# Altium project ET4207_DEBUG.PrjPcb
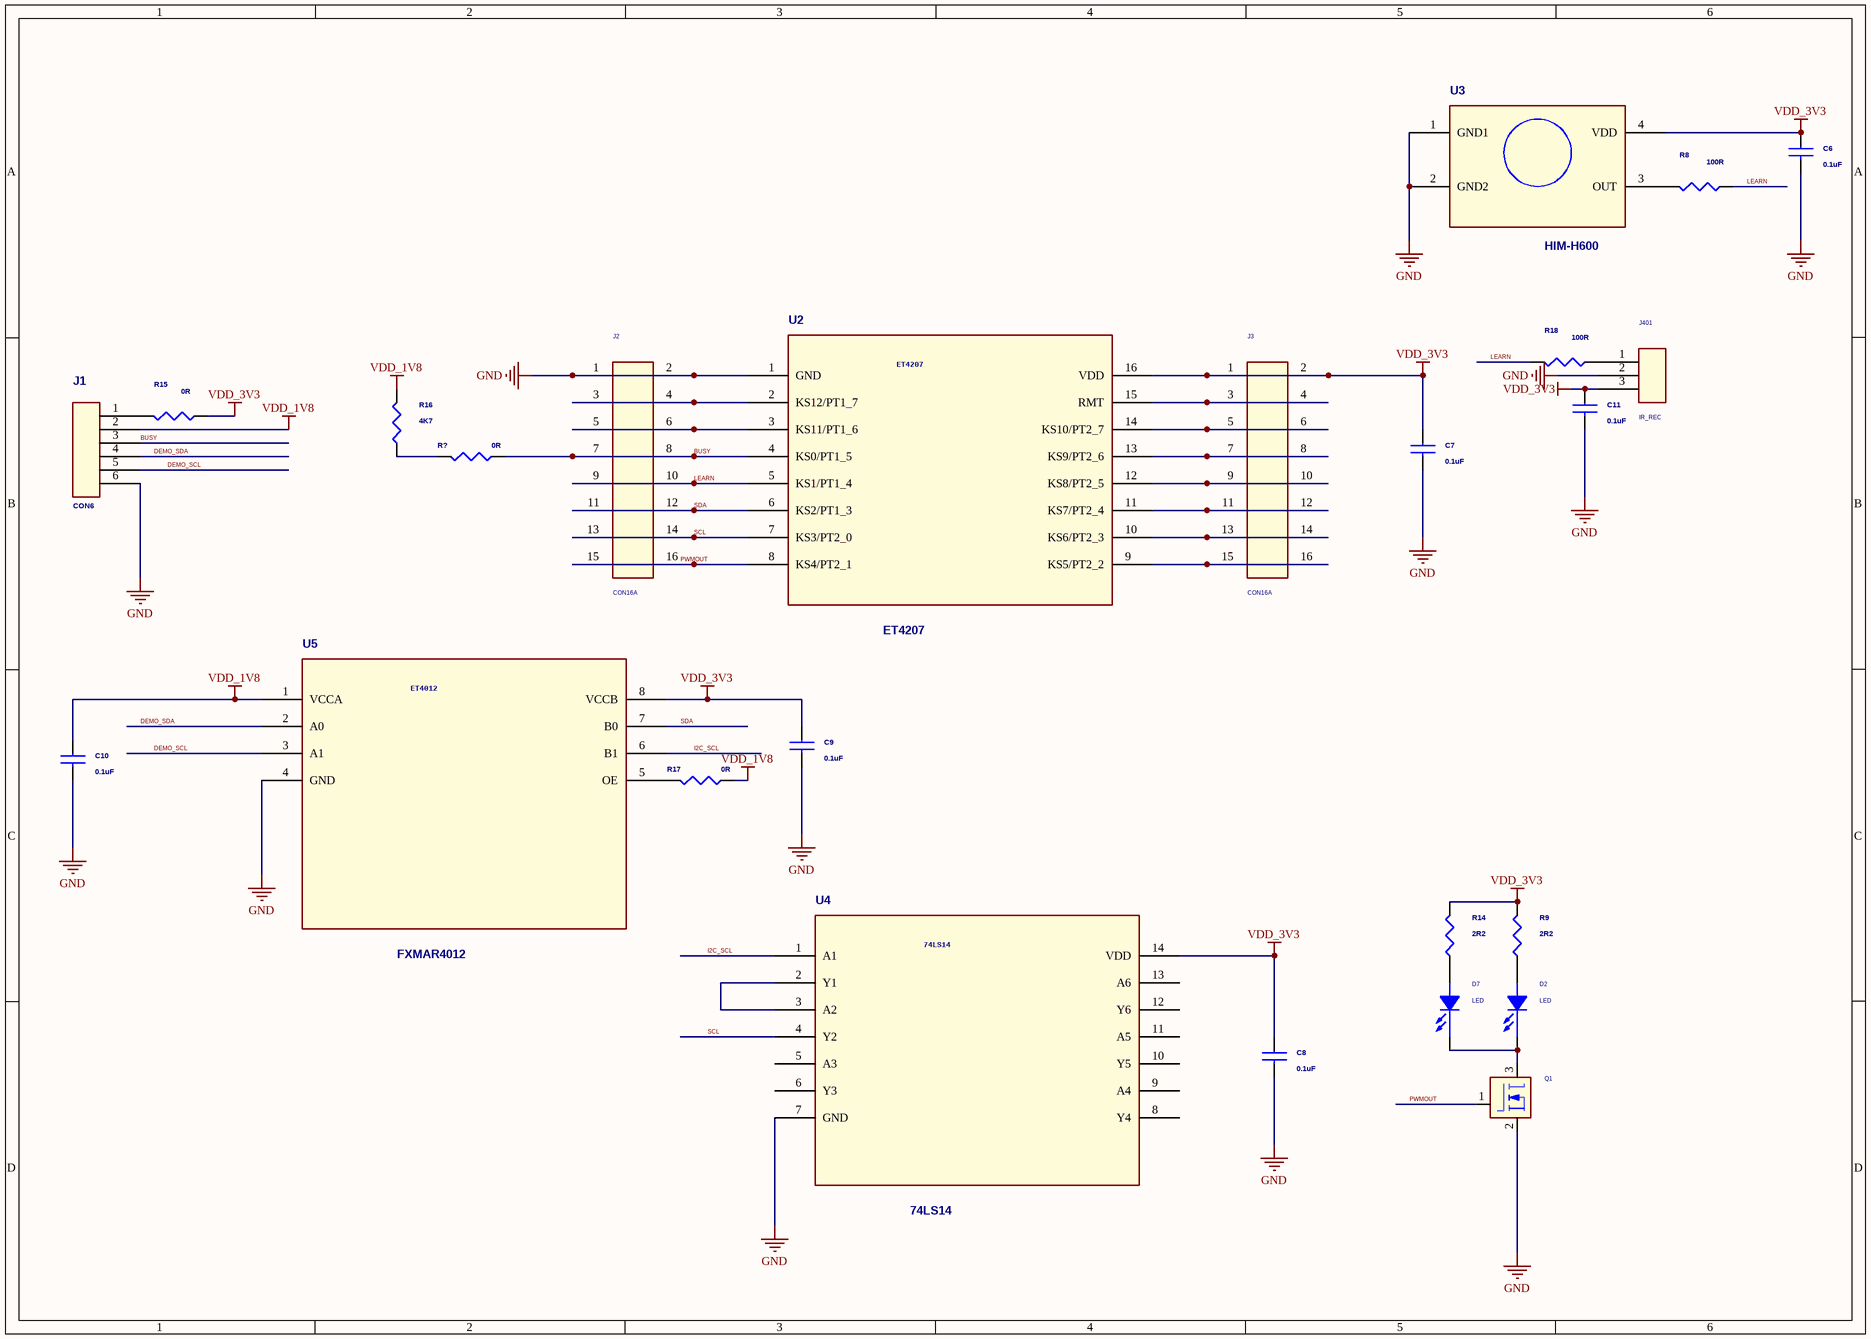
[diagram p0: ET4207_DEBUG.SchDoc]
2 sheets, 25 parts. Net scope: global (net labels, ports and power ports of the same name join across sheets).
Sheets:
  ET4207_DEBUG.SchDoc
  02 Block.SchDoc

## Sheet ET4207_DEBUG.SchDoc
size 350 x 250 mm

### Parts
C6  0.1uF  [SC0805]
C7  0.1uF  [SC0805]
C8  0.1uF  [SC0805]
C9  0.1uF  [SC0805]
C10  0.1uF  [SC0805]
C11  0.1uF  [SC0805]
D2  LED  [LED_0805d]
D7  LED  [LED_0805d]
J1  CON6  [hx6v]
J2  CON16A  [DIP16-2.54]
J3  CON16A  [HDR16P254]
J401  IR_REC  [LED_DUL]
Q1  BSS138LT3G  [SOT_23_321]  (value not drawn)
R8  100R  [SR0805]
R9  2R2  [SR0805]
R14  2R2  [SR0805]
R15  0R  [SR0805]
R16  4K7  [SR0805]
R17  0R  [SR0805]
R18  100R  [SR0805]
R?  0R  [SR0805]
U2  ET4207  [SOP16]
U3  HIM-H600  [LEDSC254P435X510X80-4N]
U4  74LS14  [sop14]
U5  FXMAR4012  [umlp8]

### Nets
GND: C6.2 C7.2 C8.2 C9.2 C10.2 C11.2 J1.6 J2.1 J2.2 J401.2(GND) Q1.2(S) U2.1(GND) U3.1(GND1) U3.2(GND2) U4.7(GND) U5.4(GND)
VDD_1V8: C10.1 J1.2 R16.2 R17.1 U5.1(VCCA)
VDD_3V3: C6.1 C7.1 C8.1 C9.1 C11.1 J3.1 J3.2 J401.3(VCC) R9.2 R14.2 R15.1 U2.16(VDD) U3.4(VDD) U4.14(VDD) U5.8(VCCB)
BUSY: J1.3 J2.7 J2.8 R?.1 U2.4(KS0/PT1_5)
DEMO_SCL: J1.5 U5.3(A1)
DEMO_SDA: J1.4 U5.2(A0)
I2C_SCL: U4.1(A1) U5.6(B1)
LEARN: J2.9 J2.10 R8.1 R18.2 U2.5(KS1/PT1_4)
PWMOUT: J2.15 J2.16 Q1.1(G) U2.8(KS4/PT2_1)
SCL: J2.13 J2.14 U2.7(KS3/PT2_0) U4.4(Y2)
SDA: J2.11 J2.12 U2.6(KS2/PT1_3) U5.7(B0)
NetD2_1: D2.1(ANODE) R9.1
NetD2_2: D2.2(CATHODE) D7.2(CATHODE) Q1.3(D)
NetD7_1: D7.1(ANODE) R14.1
NetJ1_1: J1.1 R15.2
NetJ2_3: J2.3 J2.4 U2.2(KS12/PT1_7)
NetJ2_5: J2.5 J2.6 U2.3(KS11/PT1_6)
NetJ3_3: J3.3 J3.4 U2.15(RMT)
NetJ3_5: J3.5 J3.6 U2.14(KS10/PT2_7)
NetJ3_7: J3.7 J3.8 U2.13(KS9/PT2_6)
NetJ3_9: J3.9 J3.10 U2.12(KS8/PT2_5)
NetJ3_11: J3.11 J3.12 U2.11(KS7/PT2_4)
NetJ3_13: J3.13 J3.14 U2.10(KS6/PT2_3)
NetJ3_15: J3.15 J3.16 U2.9(KS5/PT2_2)
NetJ401_1: J401.1(IROUT) R18.1
NetR8_2: R8.2 U3.3(OUT)
NetR16_1: R16.1 R?.2
NetR17_2: R17.2 U5.5(OE)
NetU4_2: U4.2(Y1) U4.3(A2)

Not connected (* = marked no-connect by the designer): U4 5(A3) 6(Y3) 8(Y4) 9(A4) 10(Y5) 11(A5) 12(Y6) 13(A6)

### Notes on the sheet
- (in symbol STM32F103C8_2) ET4012

### Library data of the parts
C6-C11 = CAPACITOR NON-POL
D2 D7 = LED_3
J2 J3 = CON16A_0
J401 = CON3_0
Q1 = MOSFET_I_EN_GSD: MOSFET N-CH 50V 200MA SOT-23; TI_Part_No: TI-MOS-BSS138LT3G; Mfr_Name: On Semi; Distributor_Part_Number: BSS138LT3GOSCT-ND; Datasheet: http://www.onsemi.com/pub_link/Collateral/BSS138LT1-D.PDF; Mfr_Part_Number: BSS138LT3G
R8 R9 R14-R18 R? = RESISTOR: MODULE: CPU
U2 = STM32F103C8_0
U3 = LPC111x_7: DEVICE: ET4003YD; MODULE: CPU
U4 = STM32F103C8_1
U5 = STM32F103C8_2

## Sheet 02 Block.SchDoc
size 420 x 297 mm
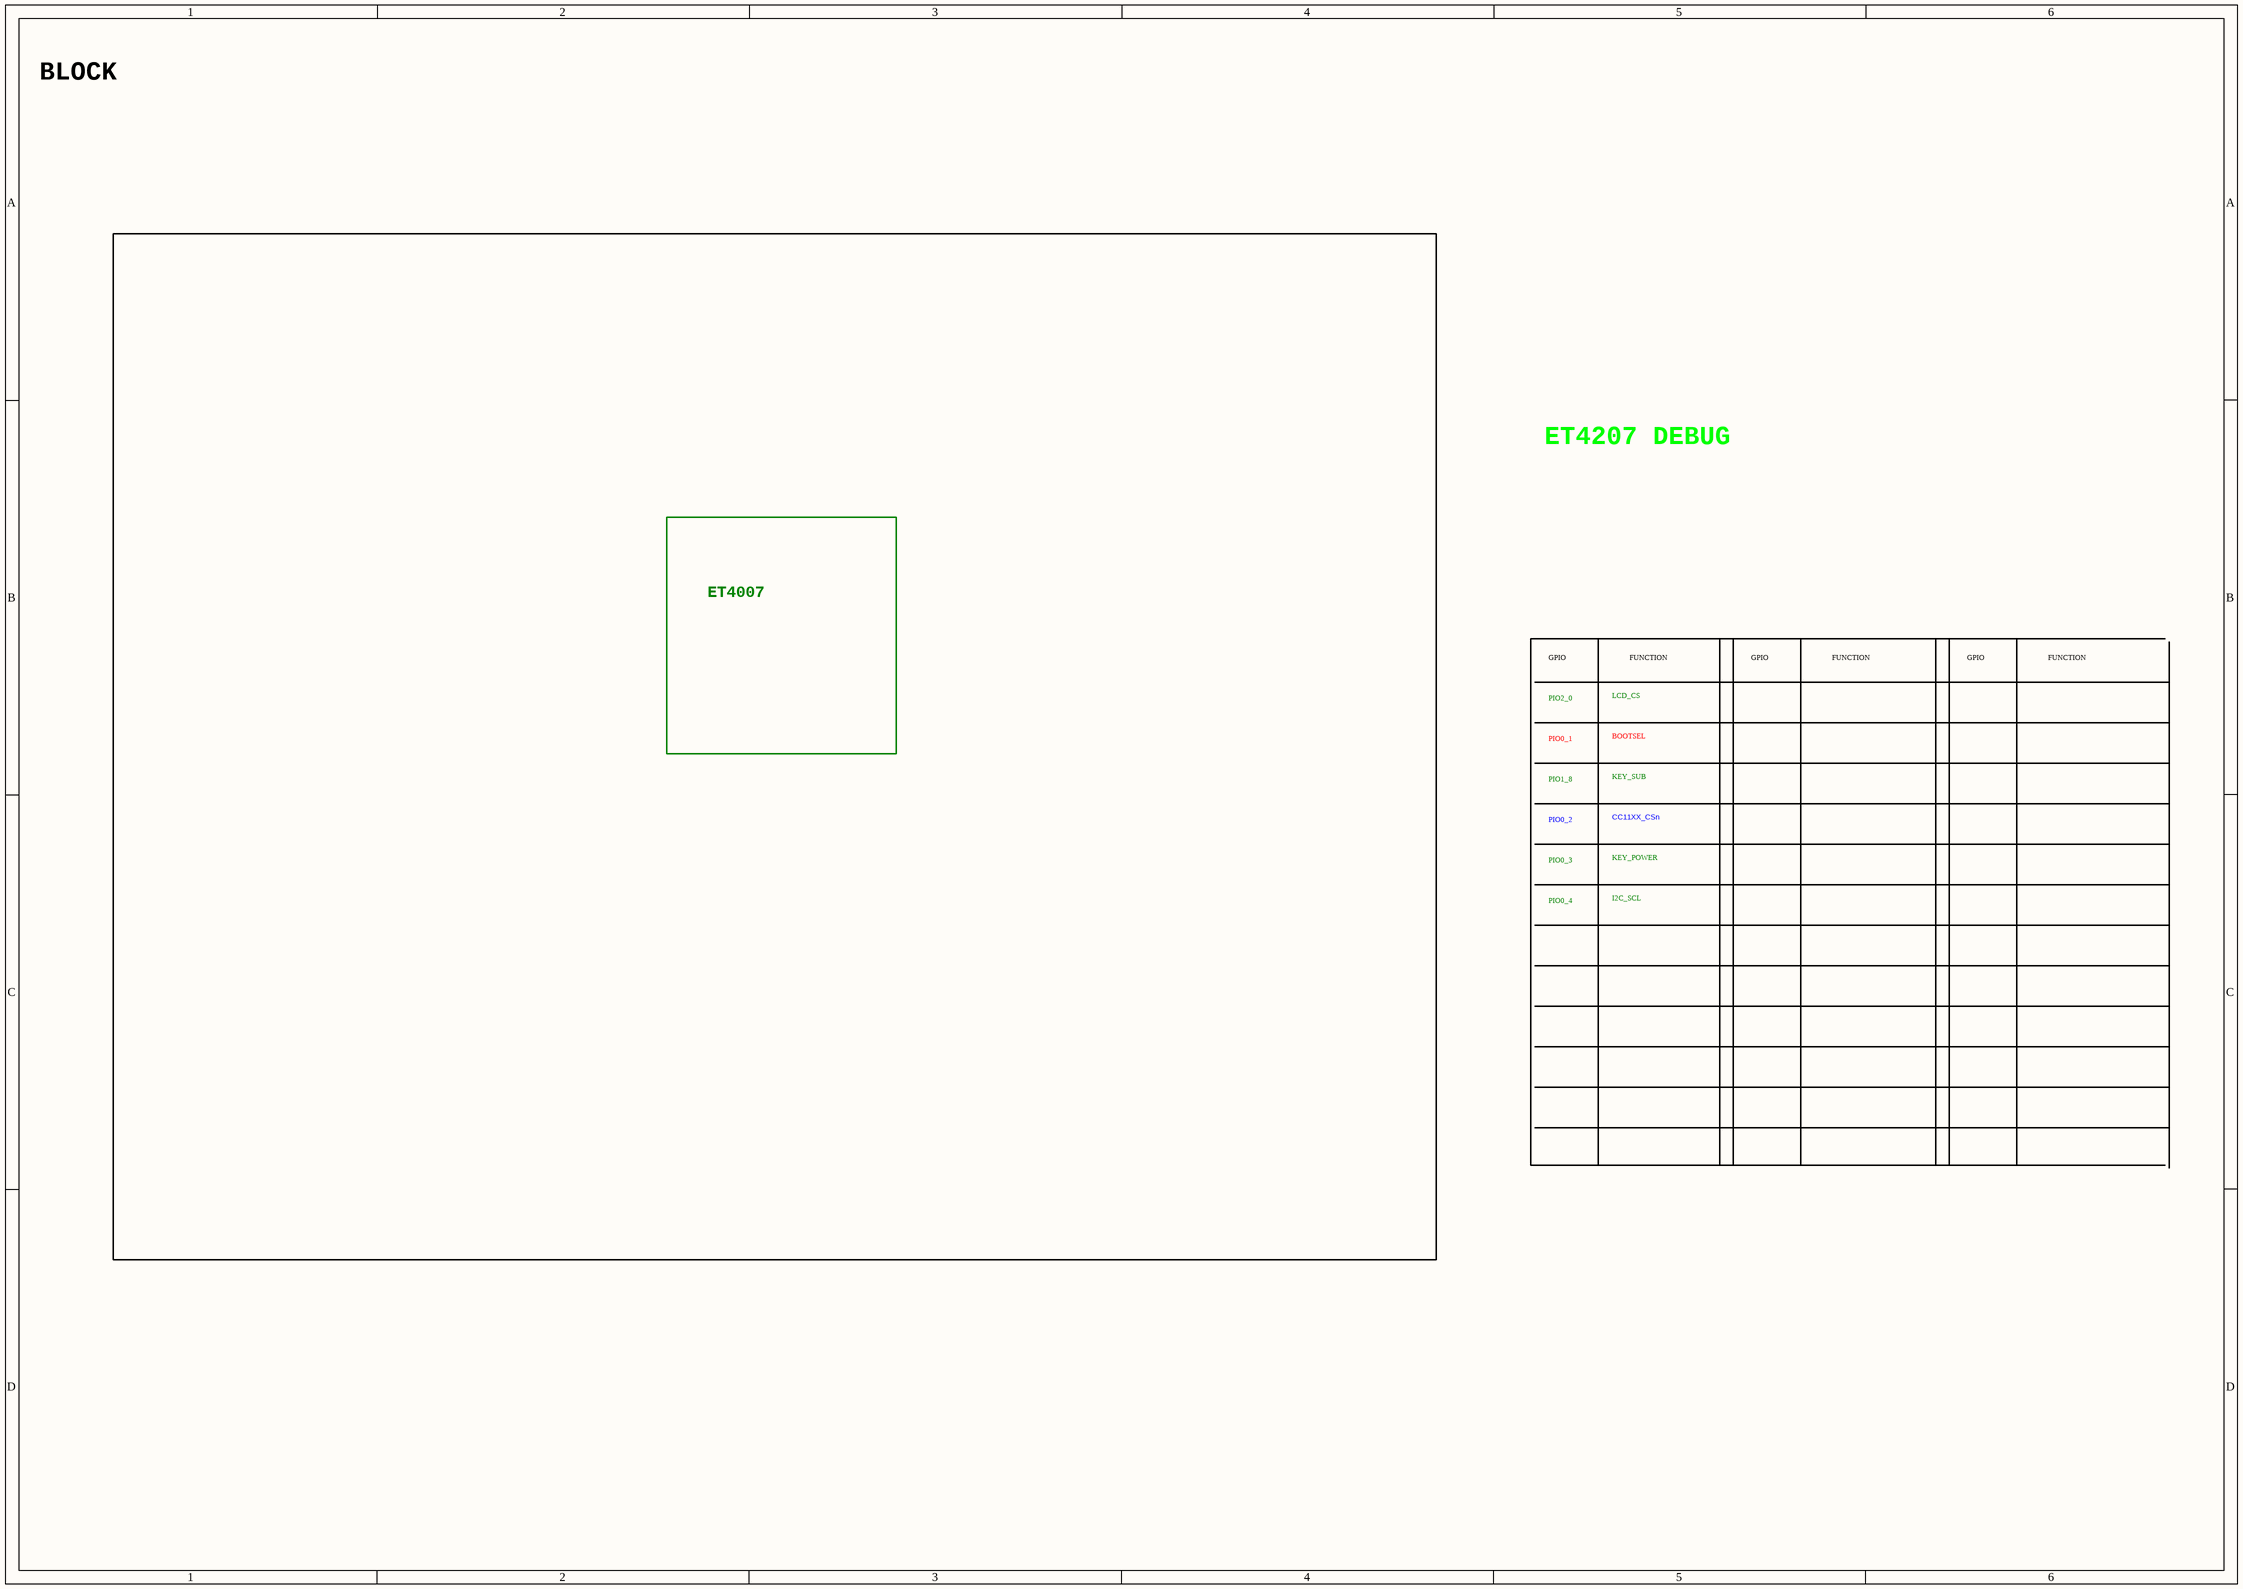
[diagram p1: 02 Block.SchDoc]

### Notes on the sheet
- BLOCK
- ET4207 DEBUG
- ET4007
- GPIO
- FUNCTION
- PIO2_0
- LCD_CS
- PIO0_1
- PIO1_8
- BOOTSEL
- KEY_SUB
- PIO0_3
- PIO0_2
- CC11XX_CSn
- KEY_POWER
- PIO0_4
- I2C_SCL